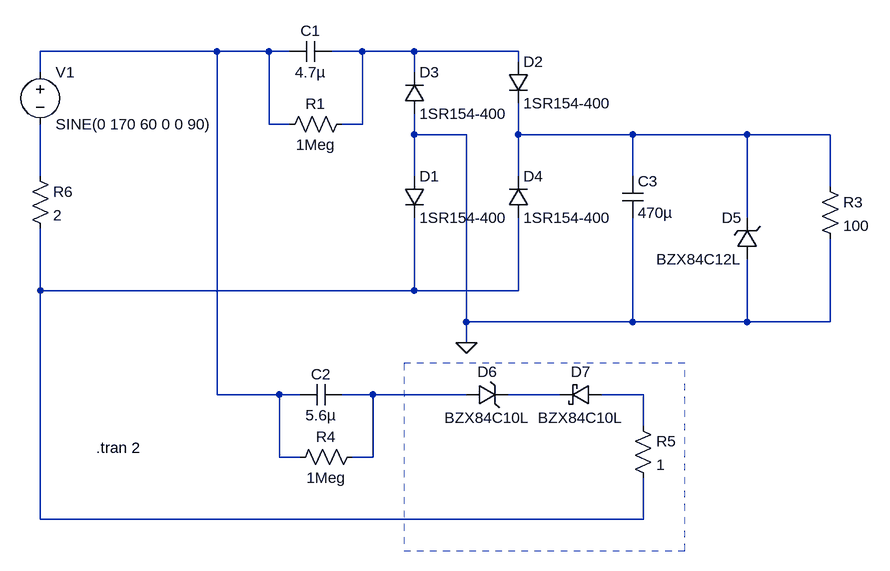
[diagram p0: schematic uvc_air_filter_psu.asc]
uvc_air_filter_psu.asc, the LTspice schematic file:
Version 4
SHEET 1 1748 836
WIRE 0 0 -272 0
WIRE 80 0 0 0
WIRE 112 0 80 0
WIRE 224 0 176 0
WIRE 304 0 224 0
WIRE 464 0 304 0
WIRE 464 16 464 0
WIRE -272 32 -272 0
WIRE 304 32 304 0
WIRE 80 112 80 0
WIRE 112 112 80 112
WIRE 224 112 224 0
WIRE 224 112 192 112
WIRE 304 128 304 96
WIRE 384 128 304 128
WIRE 464 128 464 80
WIRE 640 128 464 128
WIRE 816 128 640 128
WIRE 944 128 816 128
WIRE -272 192 -272 112
WIRE 304 192 304 128
WIRE 464 192 464 128
WIRE 640 192 640 128
WIRE 944 208 944 128
WIRE 816 256 816 128
WIRE -272 368 -272 272
WIRE 304 368 304 256
WIRE 304 368 -272 368
WIRE 464 368 464 256
WIRE 464 368 304 368
WIRE 384 416 384 128
WIRE 640 416 640 256
WIRE 640 416 384 416
WIRE 816 416 816 320
WIRE 816 416 640 416
WIRE 944 416 944 288
WIRE 944 416 816 416
WIRE 384 448 384 416
WIRE 0 528 0 0
WIRE 96 528 0 528
WIRE 128 528 96 528
WIRE 240 528 192 528
WIRE 384 528 240 528
WIRE 528 528 448 528
WIRE 656 528 592 528
WIRE 656 576 656 528
WIRE 96 624 96 528
WIRE 128 624 96 624
WIRE 240 624 240 528
WIRE 240 624 208 624
WIRE -272 720 -272 368
WIRE 656 720 656 656
WIRE 656 720 -272 720
FLAG 384 448 0
SYMBOL voltage -272 16 R0
WINDOW 123 0 0 Left 0
WINDOW 39 0 0 Left 0
SYMATTR InstName V1
SYMATTR Value SINE(0 170 60 0 0 90)
SYMBOL cap 176 -16 R90
WINDOW 0 0 32 VBottom 2
WINDOW 3 32 32 VTop 2
SYMATTR InstName C1
SYMATTR Value 4.7µ
SYMBOL res 208 96 R90
WINDOW 0 0 56 VBottom 2
WINDOW 3 32 56 VTop 2
SYMATTR InstName R1
SYMATTR Value 1Meg
SYMBOL diode 288 192 R0
SYMATTR InstName D1
SYMATTR Value 1SR154-400
SYMBOL diode 448 16 R0
SYMATTR InstName D2
SYMATTR Value 1SR154-400
SYMBOL diode 288 96 M180
WINDOW 0 24 64 Left 2
WINDOW 3 24 0 Left 2
SYMATTR InstName D3
SYMATTR Value 1SR154-400
SYMBOL diode 448 256 M180
WINDOW 0 24 64 Left 2
WINDOW 3 24 0 Left 2
SYMATTR InstName D4
SYMATTR Value 1SR154-400
SYMBOL res 928 192 R0
SYMATTR InstName R3
SYMATTR Value 100
SYMBOL cap 624 192 R0
SYMATTR InstName C3
SYMATTR Value 470µ
SYMBOL zener 832 320 R180
WINDOW 0 24 64 Left 2
WINDOW 3 24 0 Left 2
SYMATTR InstName D5
SYMATTR Value BZX84C12L
SYMBOL cap 192 512 R90
WINDOW 0 0 32 VBottom 2
WINDOW 3 32 32 VTop 2
SYMATTR InstName C2
SYMATTR Value 5.6µ
SYMBOL res 224 608 R90
WINDOW 0 0 56 VBottom 2
WINDOW 3 32 56 VTop 2
SYMATTR InstName R4
SYMATTR Value 1Meg
SYMBOL zener 384 544 R270
WINDOW 0 36 32 VTop 2
WINDOW 3 -4 32 VBottom 2
SYMATTR InstName D6
SYMATTR Value BZX84C10L
SYMBOL schottky 592 512 R90
WINDOW 0 -4 32 VBottom 2
WINDOW 3 36 32 VTop 2
SYMATTR InstName D7
SYMATTR Value BZX84C10L
SYMATTR Description Zener Diode
SYMATTR Type zener
SYMBOL res 640 560 R0
SYMATTR InstName R5
SYMATTR Value 1
SYMBOL res -288 176 R0
SYMATTR InstName R6
SYMATTR Value 2
TEXT -186 610 Left 2 !.tran 2
RECTANGLE Normal 288 768 720 480 2

The netlist it stands for:
* uvc_air_filter_psu.asc
V1 N001 N004 SINE(0 170 60 0 0 90)
C1 N002 N001 4.7µ
R1 N002 N001 1Meg
D1 0 N005 1SR154-400
D2 N002 N003 1SR154-400
D3 0 N002 1SR154-400
D4 N005 N003 1SR154-400
R3 N003 0 100
C3 N003 0 470µ
D5 0 N003 BZX84C12L
C2 N006 N001 5.6µ
R4 N006 N001 1Meg
D6 N006 N007 BZX84C10L
D7 N008 N007 BZX84C10L
R5 N008 N005 1
R6 N004 N005 2
.model D D
.lib standard.dio
.tran 2
.backanno
.end